# Altium schematic sheet WIFI_Unit.SchDoc
size C
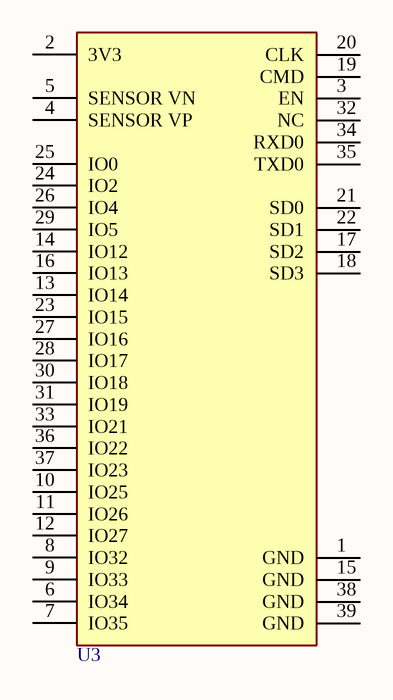
[diagram p0: WIFI_Unit.SchDoc]

## Parts
U3  BLE/WIFI Module  [Espressif_ESP-WROOM-32_0]  (value not drawn)

## Nets

Not connected (* = marked no-connect by the designer): U3 1(GND) 2(3V3) 3(EN) 4(SENSOR_VP) 5(SENSOR_VN) 6(IO34) 7(IO35) 8(IO32) 9(IO33) 10(IO25) 11(IO26) 12(IO27) 13(IO14) 14(IO12) 15(GND) 16(IO13) 17(SD2) 18(SD3) 19(CMD) 20(CLK) 21(SD0) 22(SD1) 23(IO15) 24(IO2) 25(IO0) 26(IO4) 27(IO16) 28(IO17) 29(IO5) 30(IO18) 31(IO19) 32(NC) 33(IO21) 34(RXD0) 35(TXD0) 36(IO22) 37(IO23) 38(GND) 39(GND)

## Notes on the sheet
- CONFIDENTAL. Do not distribute.
- Page Contents:
- Title:
- Company
- Logo
- Date:
- SIZE:
- C
- DWG Num:
- Time:
- Variant:
- Sheet
- Revision:
- of
- Drawn by:
- Checked by:

## Library data of the parts
U3 = IC_Espressif_ESP-WROOM-32_eec: IC SPRESSIF ESP32 BLUETOOTH WIFI Module; helpURL: https://upverter.com/upn/revision/247263e65b82b491/; ComponentLink2Description: Datasheet; Temperature: -40°C to +85°C; Package: MOD_SMT; Supplier 2: Mouser; Supplier 1: Digi-Key; ComponentLink1URL: https://upverter.com/upn/revision/247263e65b82b491/; Supplier Part Number 2: 485-3320; Supplier Part Number 1: 1188-1178-ND; Manufacturer: Espressif; ComponentLink1Description: Upverter; ComponentLink2URL: http://www.espressif.com/sites/default/files/documentation/esp-wroom-32_datasheet_en.pdf; RoHS: TRUE; Mouser Part Number: 485-3320; Temperature Range High: +85°C; Digikey Description: IC SPRESSIF ESP32 BLUETOOTH WIFI M; Digikey Part Number: 1188-1178-ND; Lead Free: yes; Temperature Range Low: -40°C; Part Number: ESP-WROOM-32